# EAGLE design LP-IMP-P1_V3 (EAGLE 7.7.0)

## Sheet 1 of 3
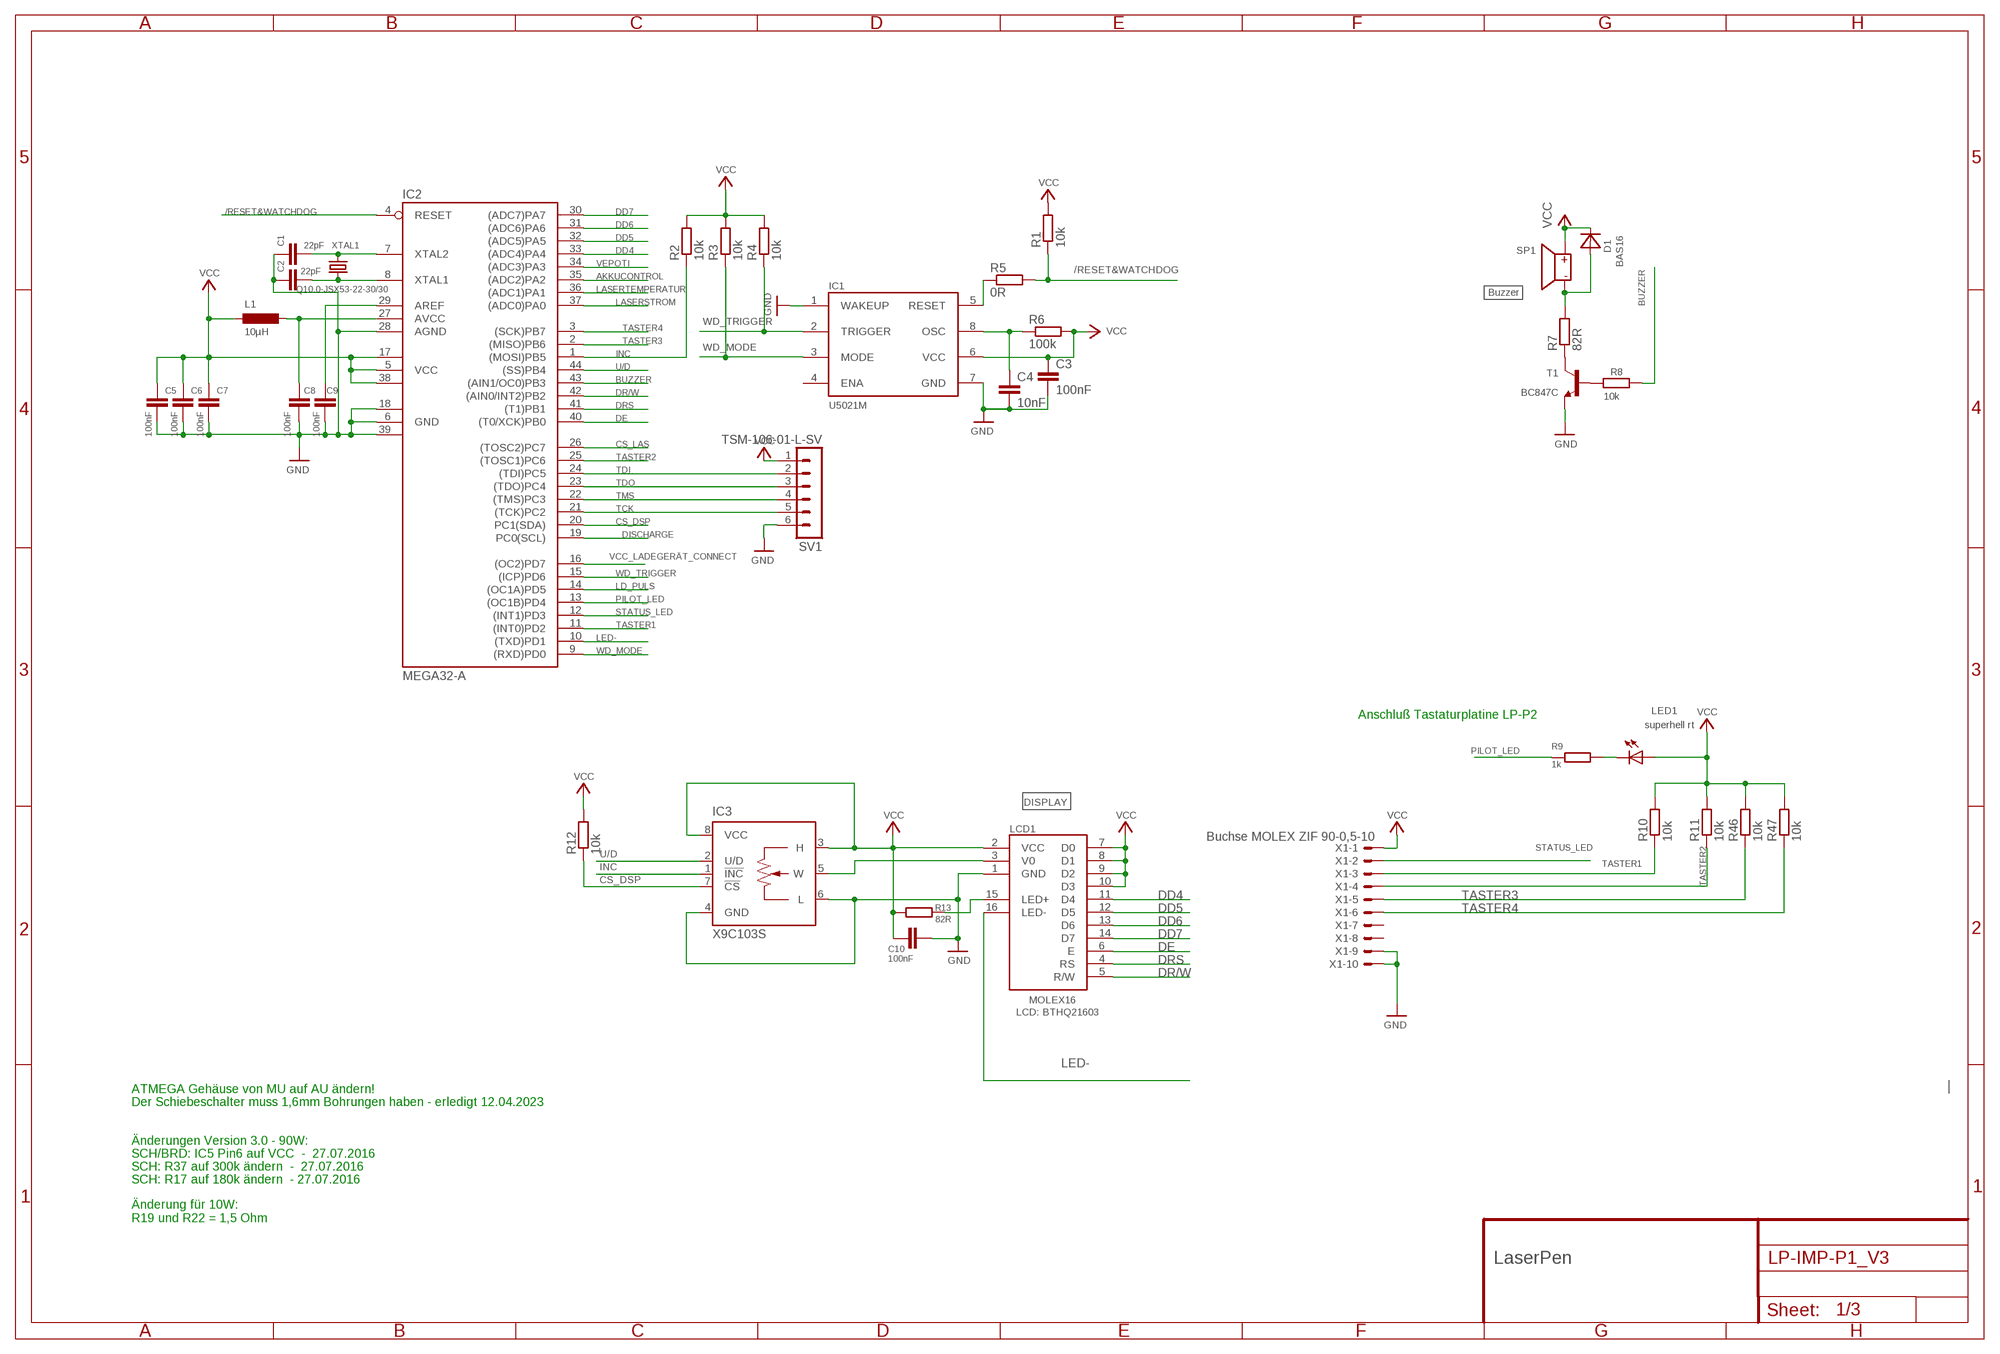
[diagram p0: schematic, sheet 1]

### Parts
C1  22pF  C-EUC0603  [C0603]
C2  22pF  C-EUC0603  [C0603]
C3  100nF  C-EUC0603  [C0603]
C4  10nF  C-EUC0603  [C0603]
C5  100nF  C-EUC0603  [C0603]
C6  100nF  C-EUC0603  [C0603]
C7  100nF  C-EUC0603  [C0603]
C8  100nF  C-EUC0603  [C0603]
C9  100nF  C-EUC0603  [C0603]
C10  100nF  C-EUC0603  [C0603]
D1  BAS16  [DIODE_SOT23]
IC1  U5021M  [SOIC8]
IC2  MEGA32-A  [TQFP44]
IC3  X9C103S  X9C102S  [SOIC08]
L1  10µH  L-EU  [R1210]
LCD1  MOLEX16  LCD1  [MOLEX]
LED1  superhell rt  LED3MM  [LED3MM]
R1  10k  R-EU_R0603  [R0603]
R2  10k  R-EU_R0603  [R0603]
R3  10k  R-EU_R0603  [R0603]
R4  10k  R-EU_R0603  [R0603]
R5  0R  R-EU_R0603  [R0603]
R6  100k  R-EU_R0603  [R0603]
R7  82R  R-EU_MELF0204R  [MINI_MELF-0204R]
R8  10k  R-EU_R0603  [R0603]
R9  1k  R-EU_R0603  [R0603]
R10  10k  R-EU_R0603  [R0603]
R11  10k  R-EU_R0603  [R0603]
R12  10k  R-EU_R0603  [R0603]
R13  82R  R-EU_MELF0204R  [MINI_MELF-0204R]
R46  10k  R-EU_R0603  [R0603]
R47  10k  R-EU_R0603  [R0603]
SP1  BUZZERS  [BUZZER]
SV1  TSM-106-01-L-SV  MA06-1MA06-1-SMD  [MA06-1-SMD]
T1  BC847C  BC848  [SOT23]
X1  Buchse MOLEX ZIF 90-0,5-10  53-10  [52745-1090]
XTAL1  Q10.0-JSX53-22-30/30  JSX53  [JSX53]

### Nets
/RESET&WATCHDOG: IC2.4(RESET) R1.1 R5.2
AKKUCONTROL: IC2.35((ADC2)PA2) ; also sheet 3
AREF: C9.1 IC2.29(AREF)
AVCC: C8.1 IC2.27(AVCC) L1.1
BUZZER: IC2.43((AIN1/OC0)PB3) R8.1
CS_DSP: IC2.20(PC1(SDA)) IC3.7(!CS) R12.1
CS_LAS: IC2.26((TOSC2)PC7) ; also sheet 2
DD4: IC2.33((ADC4)PA4) LCD1.11(D4)
DD5: IC2.32((ADC5)PA5) LCD1.12(D5)
DD6: IC2.31((ADC6)PA6) LCD1.13(D6)
DD7: IC2.30((ADC7)PA7) LCD1.14(D7)
DE: IC2.40((T0/XCK)PB0) LCD1.6(E)
DISCHARGE: IC2.19(PC0(SCL)) ; also sheet 2
DR/W: IC2.42((AIN0/INT2)PB2) LCD1.5(R/W)
DRS: IC2.41((T1)PB1) LCD1.4(RS)
GND: C1.1 C2.1 C3.2 C4.2 C5.2 C6.2 C7.2 C8.2 C9.2 C10.1 IC1.1(WAKEUP) IC1.7(GND) IC2.6(GND) IC2.18(GND1) IC2.28(AGND) IC2.39(GND2) IC3.4(GND) IC3.6(L) LCD1.1(GND) SV1.6 T1.2(E) X1.9 X1.10 ; also sheet 2,3
INC: IC2.1((MOSI)PB5) IC3.1(!INC) R2.1 ; also sheet 2
LASERSTROM: IC2.37((ADC0)PA0) ; also sheet 2
LASERTEMPERATUR: IC2.36((ADC1)PA1) ; also sheet 2
LD_PULS: IC2.14((OC1A)PD5) ; also sheet 2
LED+: LCD1.15(LED+) R13.2
LED-: IC2.10((TXD)PD1) LCD1.16(LED-)
N$2: R7.1 T1.3(C)
N$6: C1.2 IC2.7(XTAL2) XTAL1.3
N$11: IC1.5(RESET) R5.1
N$12: C4.1 IC1.8(OSC) R6.1
N$13: LED1.K(C) R9.2
N$21: C2.2 IC2.8(XTAL1) XTAL1.1
N$29: D1.1(A) R7.2 SP1.-
N$35: R8.2 T1.1(B)
PILOT_LED: IC2.13((OC1B)PD4) R9.1
STATUS_LED: IC2.12((INT1)PD3) X1.2
TASTER1: IC2.11((INT0)PD2) R10.1 X1.3
TASTER2: IC2.25((TOSC1)PC6) R11.1 X1.4
TASTER3: IC2.2((MISO)PB6) R46.1 X1.5
TASTER4: IC2.3((SCK)PB7) R47.1 X1.6
TCK: IC2.21((TCK)PC2) SV1.5
TDI: IC2.24((TDI)PC5) SV1.2
TDO: IC2.23((TDO)PC4) SV1.3
TMS: IC2.22((TMS)PC3) SV1.4
U/D: IC2.44((SS)PB4) IC3.2(U/D) ; also sheet 2
V0: IC3.5(W) LCD1.3(V0)
VCC: C3.1 C5.1 C6.1 C7.1 C10.2 D1.3(C) IC1.6(VCC) IC2.5(VCC) IC2.17(VCC1) IC2.38(VCC2) IC3.3(H) IC3.8(VCC) L1.2 LCD1.2(VCC) LCD1.7(D0) LCD1.8(D1) LCD1.9(D2) LCD1.10(D3) LED1.A R1.2 R2.2 R3.2 R4.2 R6.2 R10.2 R11.2 R12.2 R13.1 R46.2 R47.2 SP1.+ SV1.1 X1.1 ; also sheet 2,3
VCC_LADEGERÄT_CONNECT: IC2.16((OC2)PD7) ; also sheet 3
VEPOTI: IC2.34((ADC3)PA3) ; also sheet 2
WD_MODE: IC1.3(MODE) IC2.9((RXD)PD0) R3.1
WD_TRIGGER: IC1.2(TRIGGER) IC2.15((ICP)PD6) R4.1
Unconnected: IC1.4(ENA) X1.7 X1.8

### Notes on the sheet
- Buzzer
- Anschluß Tastaturplatine LP-P2
- DISPLAY
- LCD: BTHQ21603
- ATMEGA Gehäuse von MU auf AU ändern!
- Der Schiebeschalter muss 1,6mm Bohrungen haben - erledigt 12.04.2023
- Änderungen Version 3.0 - 90W:
- SCH/BRD: IC5 Pin6 auf VCC  -  27.07.2016
- SCH: R37 auf 300k ändern  -  27.07.2016
- SCH: R17 auf 180k ändern  - 27.07.2016
- Änderung für 10W:
  R19 und R22 = 1,5 Ohm
- LaserPen

## Sheet 2 of 3
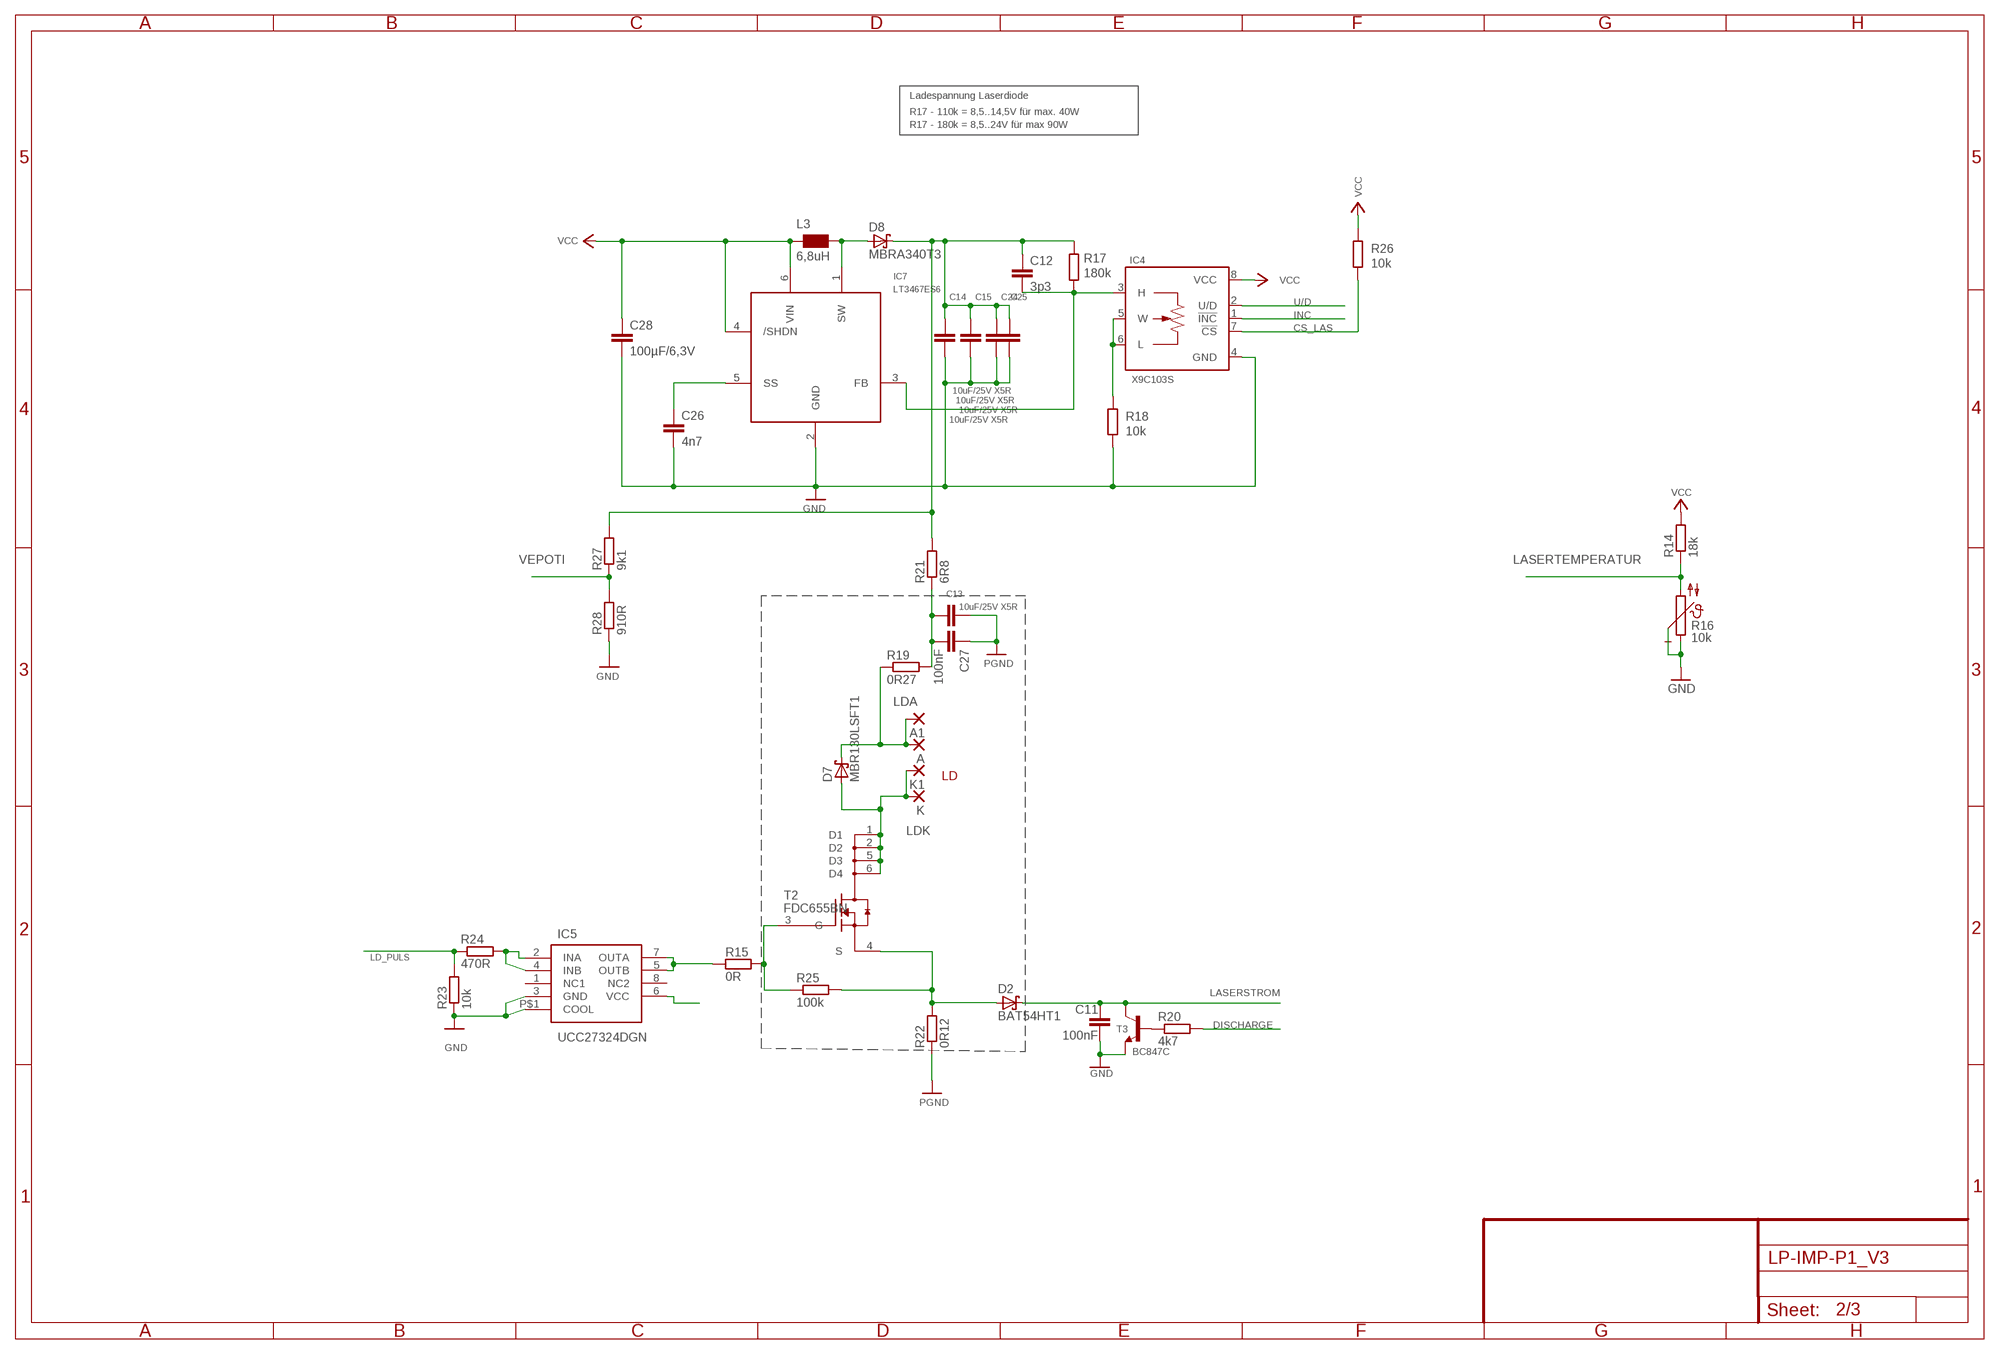
[diagram p1: schematic, sheet 2]

### Parts
A  WIREPADSMD1,27-254  [SMD1,27-2,54]
A1  WIREPADSMD1,27-254  [SMD1,27-2,54]
C11  100nF  C-EUC0603  [C0603]
C12  3p3  C-EUC0603  [C0603]
C13  10uF/25V X5R  C-EUC1210K  [C1210K]
C14  10uF/25V X5R  C-EUC1210K  [C1210K]
C15  10uF/25V X5R  C-EUC1210K  [C1210K]
C24  10uF/25V X5R  C-EUC1210K  [C1210K]
C25  10uF/25V X5R  C-EUC1210K  [C1210K]
C26  4n7  C-EUC0603K  [C0603K]
C27  100nF  C-EUC0603  [C0603]
C28  100µF/6,3V  C-EUC1210K  [C1210K]
D2  BAT54HT1  [SOD-323]
D7  MBR130LSFT1  [SOD-123LF]
D8  MBRA340T3  [SMA]
IC4  X9C103S  X9C102S  [SOIC08]
IC5  UCC27324DGN  [R-PDSO-G8]
IC7  LT3467ES6  [TSOT-23-6]
K  WIREPADSMD1,27-254  [SMD1,27-2,54]
K1  WIREPADSMD1,27-254  [SMD1,27-2,54]
L3  6,8uH  WE-PD2_S  [WE-PD2_S]
R14  18k  R-EU_R0603  [R0603]
R15  0R  R-EU_MELF0204R  [MINI_MELF-0204R]
R16  10k  NTC640SMD0805  [R0805]
R17  180k  R-EU_R0603  [R0603]
R18  10k  R-EU_R0603  [R0603]
R19  0R27  R-EU_MELF0204R  [MINI_MELF-0204R]
R20  4k7  R-EU_R0603  [R0603]
R21  6R8  R-EU_MELF0204R  [MINI_MELF-0204R]
R22  0R12  R-EU_MELF0204R  [MINI_MELF-0204R]
R23  10k  R-EU_R0603  [R0603]
R24  470R  R-EU_R0603  [R0603]
R25  100k  R-EU_R0603  [R0603]
R26  10k  R-EU_R0603  [R0603]
R27  9k1  R-EU_R0603  [R0603]
R28  910R  R-EU_R0603  [R0603]
T2  FDC655BN  [SUPERSOT-6]
T3  BC847C  BC849SMD  [SOT23-BEC]

### Nets
CS_LAS: IC4.7(!CS) R26.1 ; also sheet 1
DISCHARGE: R20.2 ; also sheet 1
GND: C11.2 C13.2 C14.2 C15.2 C24.2 C25.2 C26.2 C27.1 C28.2 IC4.4(GND) IC5.3(GND) IC5.P$1(COOL) IC7.2(GND) R16.1 R18.1 R22.1 R23.1 R28.1 T3.E ; supply symbol labelled PGND ; also sheet 1,3
INC: IC4.1(!INC) ; also sheet 1
LASERSTROM: C11.1 D2.C T3.C ; also sheet 1
LASERTEMPERATUR: R14.1 R16.2 ; also sheet 1
LD_PULS: R23.2 R24.1 ; also sheet 1
LDA: A1.1(P) A.1(P) D7.C R19.1
LDK: D7.A K1.1(P) K.1(P) T2.1(D1) T2.2(D2) T2.5(D3) T2.6(D4)
N$3: IC5.5(OUTB) IC5.7(OUTA) R15.1
N$8: IC5.2(INA) IC5.4(INB) R24.2
N$10: IC4.5(W) IC4.6(L) R18.2
N$15: R20.1 T3.B
N$18: C26.1 IC7.5(SS)
N$19: R15.2 R25.1 T2.3(G)
N$37: D8.A IC7.1(SW) L3.1
N$38: C13.1 C27.2 R19.2 R21.1
N$43: C12.2 IC4.3(H) IC7.3(FB) R17.1
U/D: IC4.2(U/D) ; also sheet 1
VCC: C28.1 IC4.8(VCC) IC5.6(VCC) IC7.4(/SHDN) IC7.6(VIN) L3.2 R14.2 R26.2 ; also sheet 1,3
VEPOTI: R27.1 R28.2 ; also sheet 1
VPULS: C12.1 C14.1 C15.1 C24.1 C25.1 D8.C R17.2 R21.2 R27.2
ZWISCHENWERT: D2.A R22.2 R25.2 T2.4(S)
Unconnected: IC5.1(NC1) IC5.8(NC2)

### Notes on the sheet
- Ladespannung Laserdiode
- R17 - 110k = 8,5..14,5V für max. 40W
- R17 - 180k = 8,5..24V für max 90W
- LD

## Sheet 3 of 3
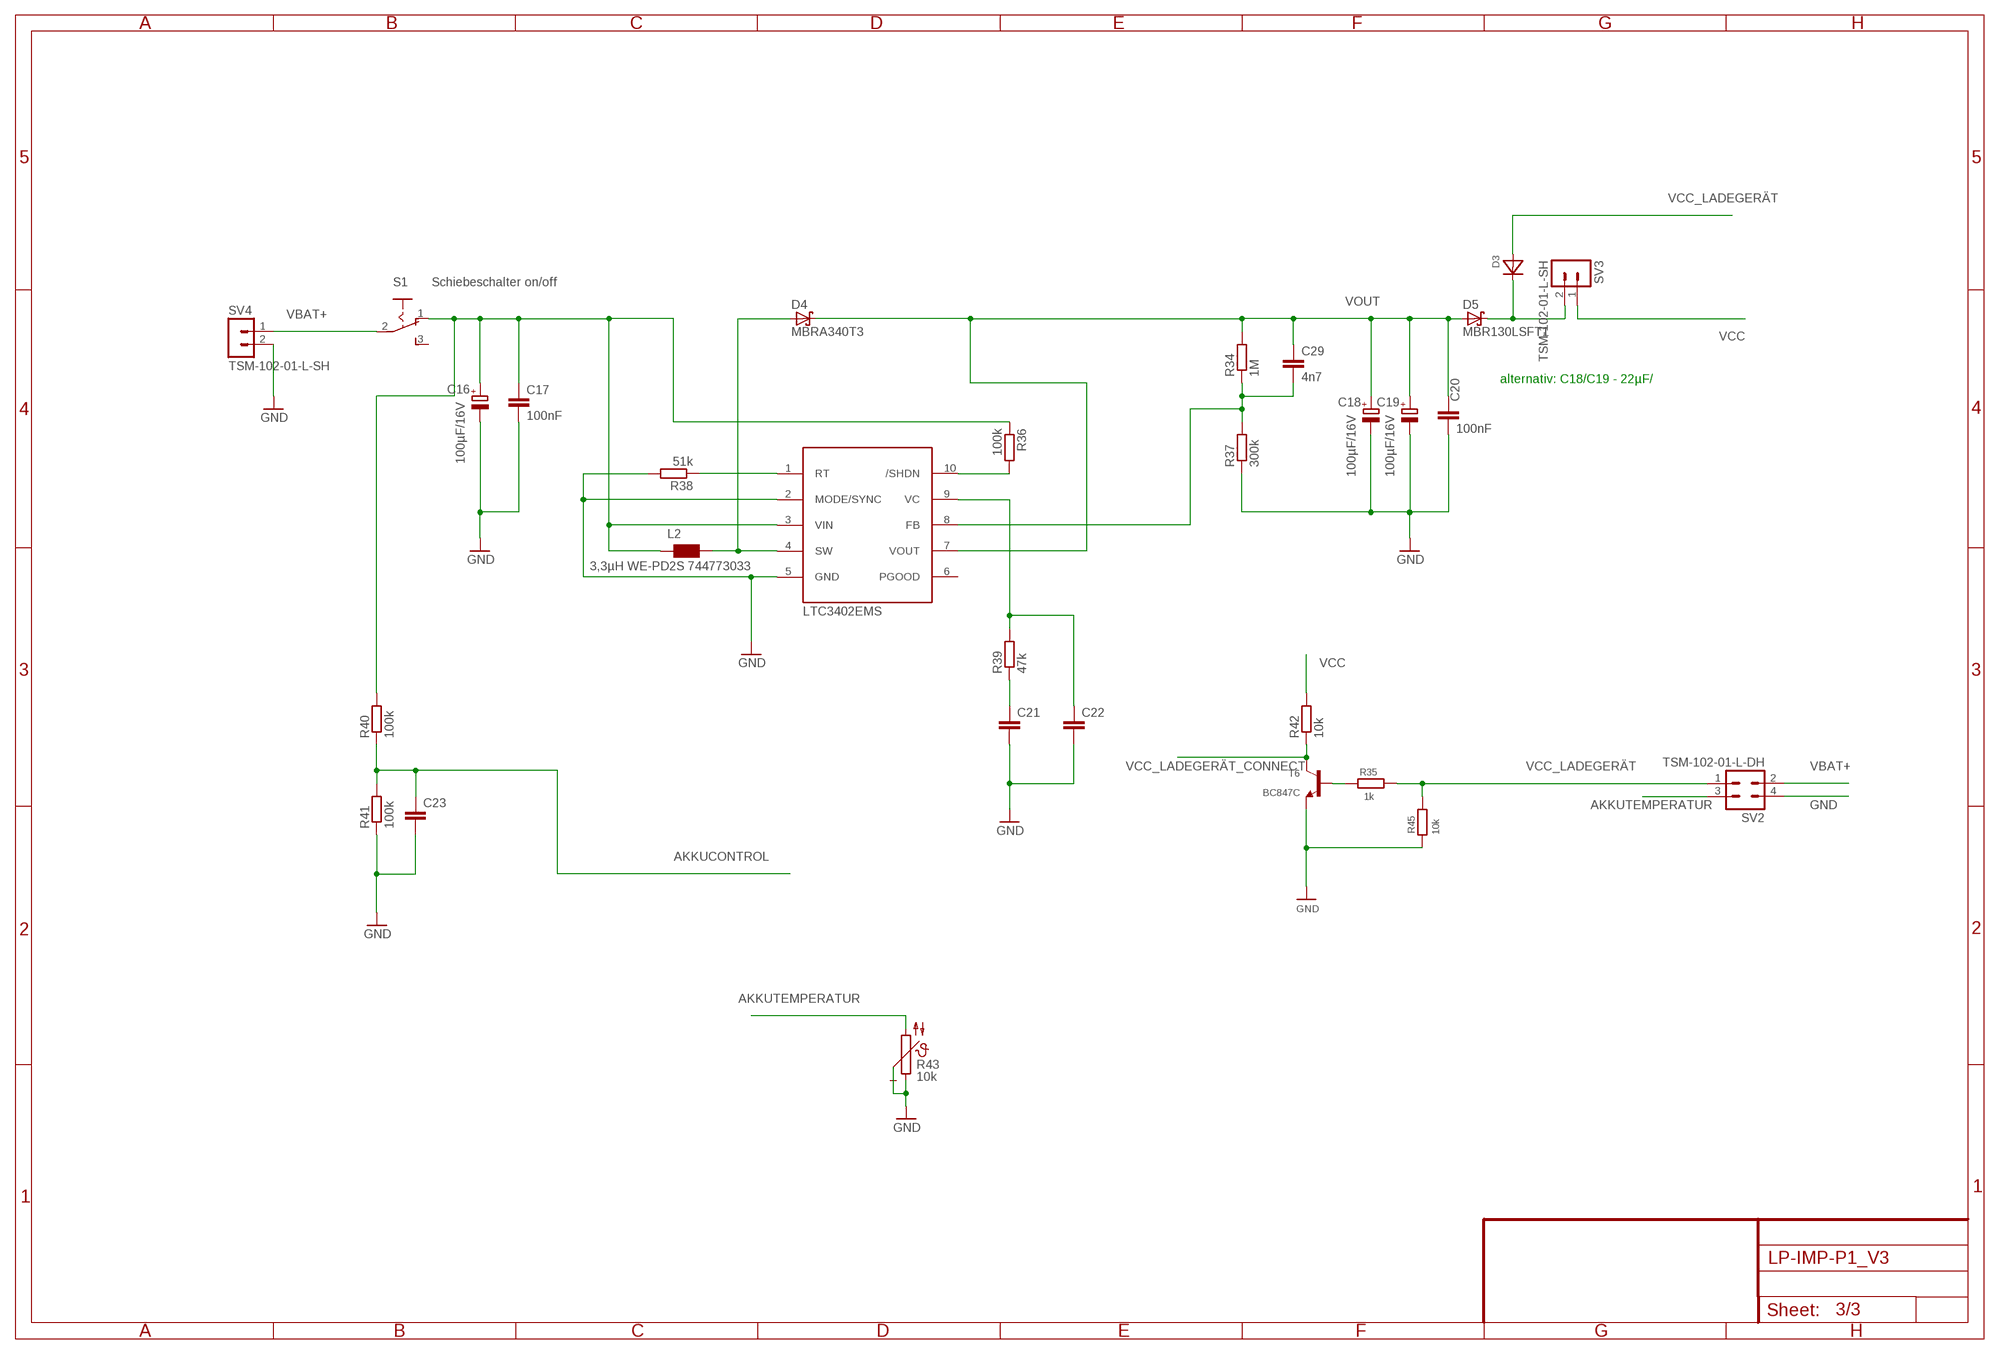
[diagram p2: schematic, sheet 3]

### Parts
C16  100µF/16V  CPOL-EUSMCD  [SMC_D]
C17  100nF  C-EUC0603K  [C0603K]
C18  100µF/16V  CPOL-EUSMCD  [SMC_D]
C19  100µF/16V  CPOL-EUSMCD  [SMC_D]
C20  100nF  C-EUC0603K  [C0603K]
C21  1nF  C-EUC0603K  [C0603K]
C22  10pF  C-EUC0603K  [C0603K]
C23  100nF  C-EUC0603K  [C0603K]
C29  4n7  C-EUC0603K  [C0603K]
D3  BAS16  [DIODE_SOT23]
D4  MBRA340T3  [SMA]
D5  MBR130LSFT1  [SOD-123LF]
IC6  LTC3402EMS  [MSOP-10]
L2  3,3µH WE-PD2S 744773033  WE-PD2_S  [WE-PD2_S]
R34  1M  R-EU_R0603  [R0603]
R35  1k  R-EU_R0603  [R0603]
R36  100k  R-EU_R0603  [R0603]
R37  300k  R-EU_R0603  [R0603]
R38  51k  R-EU_R0603  [R0603]
R39  47k  R-EU_R0603  [R0603]
R40  100k  R-EU_R0603  [R0603]
R41  100k  R-EU_R0603  [R0603]
R42  10k  R-EU_R0603  [R0603]
R43  10k  NTC640SMD0805  [R0805]
R45  10k  R-EU_R0603  [R0603]
S1  Schiebeschalter on/off  255SB  [255SB]
SV2  TSM-102-01-L-DH  MA02-2  [MA02-2-W-SMD]
SV3  TSM-102-01-L-SH  MA02-1W-SMD  [MA02-1-W-SMD]
SV4  TSM-102-01-L-SH  MA02-1W-SMD  [MA02-1-W-SMD]
T6  BC847C  BC848  [SOT23]

### Nets
AKKUCONTROL: C23.1 R40.1 R41.2 ; also sheet 1
AKKUTEMPERATUR: R43.2 SV2.3
GND: C16.- C17.2 C18.- C19.- C20.2 C21.2 C22.2 C23.2 IC6.2(MODE/SYNC) IC6.5(GND) R37.1 R38.2 R41.1 R43.1 R45.2 SV2.4 SV4.2 T6.2(E) ; also sheet 1,2
N$4: D3.3(C) D5.C SV3.2
N$7: R35.2 T6.1(B)
N$23: C29.2 IC6.8(FB) R34.1 R37.2
N$24: C22.1 IC6.9(VC) R39.2
N$32: C21.1 R39.1
N$34: D4.A IC6.4(SW) L2.1
N$36: IC6.1(RT) R38.1
N$39: IC6.10(/SHDN) R36.2
VBAT+: S1.2(P) SV2.2 SV4.1
VCC: R42.2 SV3.1 ; also sheet 1,2
VCC_LADEGERÄT: D3.1(A) R35.1 R45.1 SV2.1
VCC_LADEGERÄT_CONNECT: R42.1 T6.3(C) ; also sheet 1
VIN: C16.+ C17.1 IC6.3(VIN) L2.2 R36.1 R40.2 S1.1(O)
VOUT: C18.+ C19.+ C20.1 C29.1 D4.C D5.A IC6.7(VOUT) R34.2
Unconnected: IC6.6(PGOOD) S1.3(S)

### Notes on the sheet
- alternativ: C18/C19 - 22µF/

## Library data of the parts
A A1 K K1 = wirepad:WIREPAD: Wire PAD connect wire on PCB
C1-C15 C17 C20-C29 = rcl:C-EU: CAPACITOR, European symbol
C16 C18 C19 = rcl:CPOL-EU: POLARIZED CAPACITOR, European symbol
D1 D3 = vv32_4.10.2004_rc2vvmega32_04.10.2004_rc2:BAS16
D2 = pulslaser:BAT54HT1
D4 = LS-SP-P1:MBRA340T3
D5 D7 = pulslaser:MBR130LSFT1
D8 = pulslaser:MBRA340T3
IC1 = atmel:U5021
IC2 = atmel:MEGA32: MICROCONTROLLER 32 Kbytes FLASH 2 Kbytes SRAM 1 Kbytes EEPROM USART 8-channel 10 bit ADC Source: www.atmel.com .. doc2503.pdf
IC3 IC4 = pot-xicor:X9C102*: Digital POTENTIOMETER
IC5 = pulslaser:UCC27324DGN
IC6 = pulslaser:LTC3402EMS
IC7 = pulslaser:LT3467ES6
L1 = rcl:L-EU: INDUCTOR, European symbol
L2 = wuerth-elektronik_EAGLE_v4:WE-PD2: SMD-Power Inductors WE-PD2 Is recommended for the application with switching regulators from National Semiconductor, Linear Technology, Texas Instruments and Fairchild Semiconductor -- Switching regulators with low operating voltages (computer, laptop, mobile phones, pagers) -- Integrated DC/DC-converter
L3 = wuerth-elektronik:WE-PD2: SMD-Power Inductors WE-PD2 Is recommended for the application with switching regulators from National Semiconductor, Linear Technology, Texas Instruments and Fairchild Semiconductor -- Switching regulators with low operating voltages (computer, laptop, mobile phones, pagers) -- Integrated DC/DC-converter
LCD1 = IBB:LCD: LCD, 2x16, Batron
LED1 = led:LED: LED OSRAM: - CHIPLED LG R971, LG N971, LY N971, LG Q971, LY Q971, LO R971, LY R971 LH N974, LH R974 LS Q976, LO Q976, LY Q976 LO Q996 - Hyper CHIPLED LW Q18S LB Q993, LB Q99A, LB R99A - SideLED LS A670, LO A670, LY A670, LG A670, LP A670 LB A673, LV A673, LT A673, LW A673 LH A674 LY A675 LS A676, LA A676, LO A676, LY A676, LW A676 LS A679, LY A679, LG A679 - Hyper Micro SIDELED® LS Y876, LA Y876, LO Y876, LY Y876 LT Y87S - SmartLED LW L88C, LW L88S LB L89C, LB L89S, LG L890 LS L89K, LO L89K, LY L89K LS L896, LA L896, LO L896, LY L896 - TOPLED LS T670, LO T670, LY T670, LG T670, LP T670 LSG T670, LSP T670, LSY T670, LOP T670, LYG T670 LG T671, LOG T671, LSG T671 LB T673, LV T673, LT T673, LW T673 LH T674 LS T676, LA T676, LO T676, LY T676, LB T676, LH T676, LSB T676, LW T676 LB T67C, LV T67C, LT T67C, LS T67K, LO T67K, LY T67K, LW E67C LS E67B, LA E67B, LO E67B, LY E67B, LB E67C, LV E67C, LT E67C LW T67C LS T679, LY T679, LG T679 LS T770, LO T770, LY T770, LG T770, LP T770 LB T773, LV T773, LT T773, LW T773 LH T774 LS E675, LA E675, LY E675, LS T675 LS T776, LA T776, LO T776, LY T776, LB T776 LHGB T686 LT T68C, LB T68C - Hyper Mini TOPLED® LB M676 - Mini TOPLED Santana® LG M470 LS M47K, LO M47K, LY M47K Source: http://www.osram.convergy.de/
R1-R15 R17-R28 R34-R42 R45-R47 = rcl:R-EU_: RESISTOR, European symbol
R16 R43 = ptc-ntc:NTC640: PHILIPS NTC
S1 = switch:255SB: SLIDING SWITCH Distributor Buerklin, 11G810
SP1 = IBB:BUZZER: ST03CH, Buzzer, 5V, SMD, Soberton
SV1 = con-lstb:MA06-1: PIN HEADER
SV2 = con-lstb:MA02-2
SV3 SV4 = con-lstb:MA02-1
T1 T6 = transistor:BC848: NPN TRANSISTOR
T2 = pulslaser:FDC655BN
T3 = transistor-npn:BC849*: NPN Transistor
X1 = con-molex:53?-10: CONNECTOR wire to board 1.25 mm (.049 inch) pitch header
XTAL1 = pulslaser:JSX53

## Board
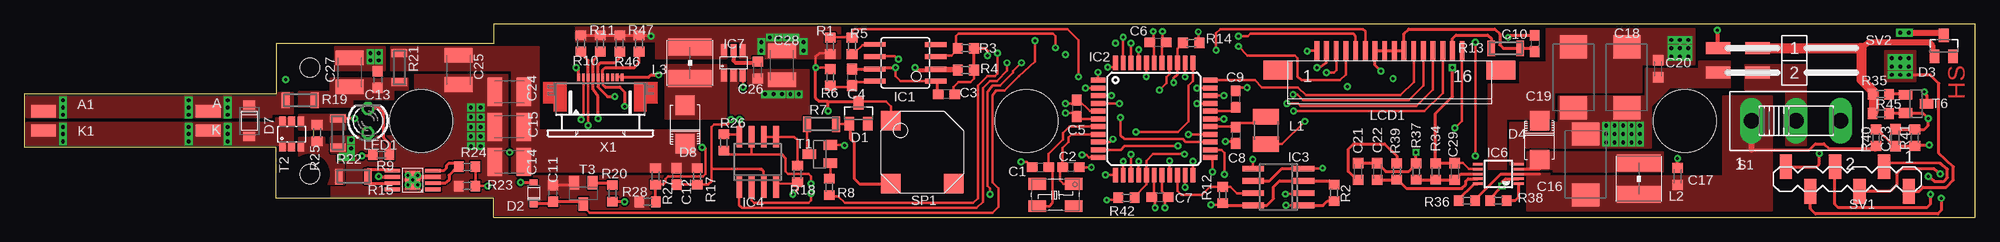
[diagram p3: board, top side]
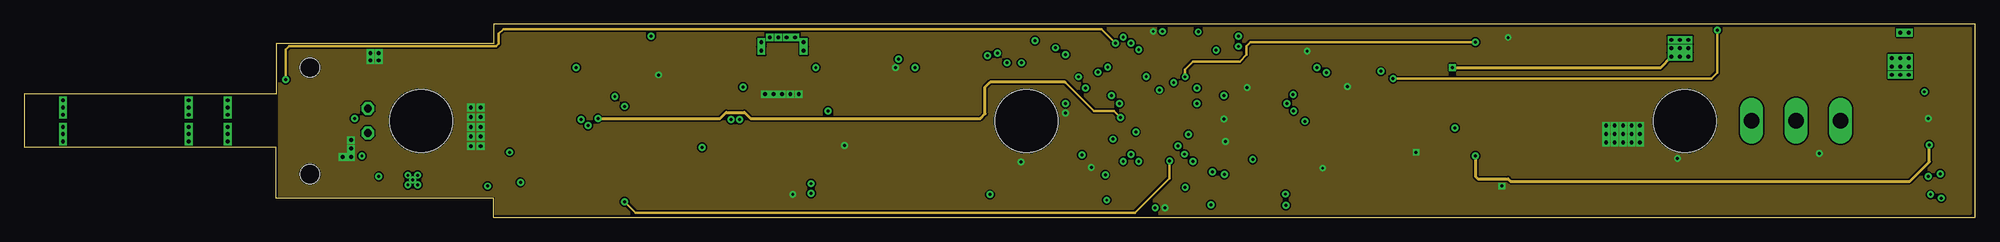
[diagram p4: board, inner layer gnd]
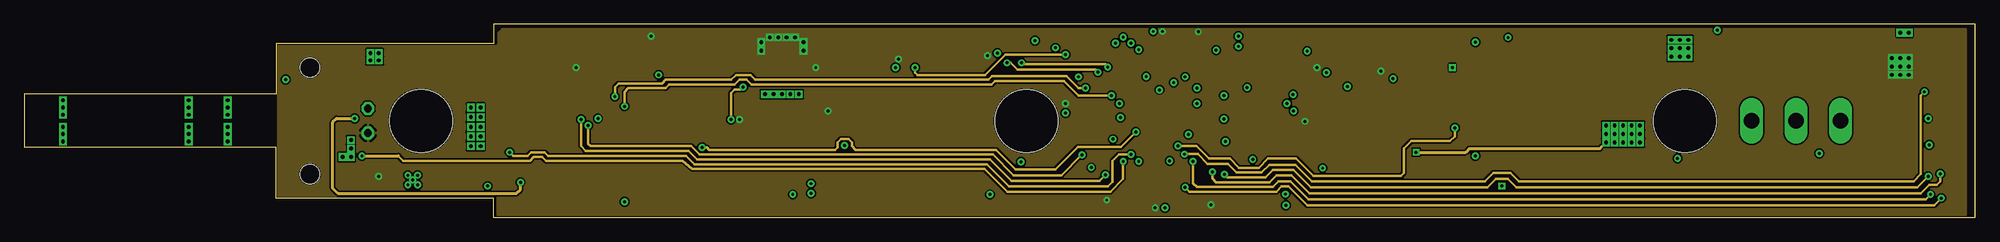
[diagram p5: board, inner layer vcc]
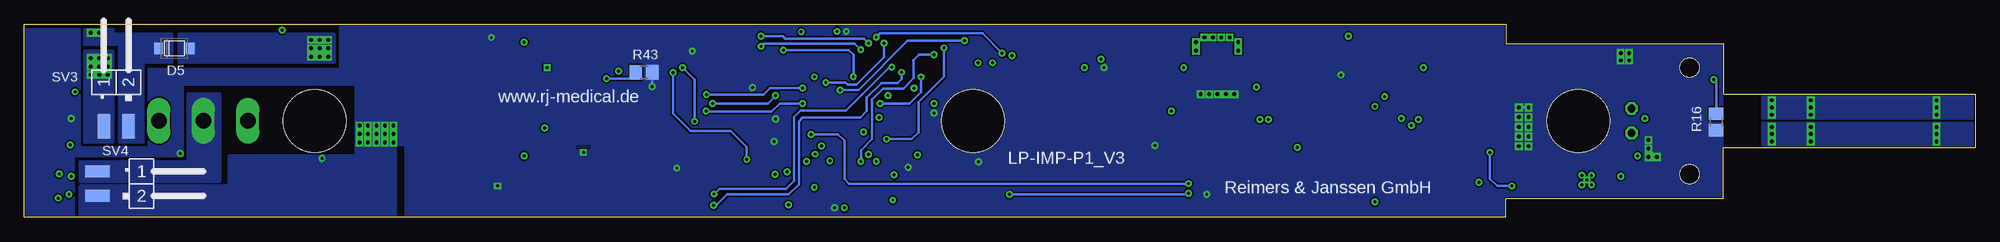
[diagram p6: board, bottom side, seen from below]

Size 201.5 x 20 mm. Coordinates in mm from the lower left corner, seen from the top.
Copper layers (1+2*15+16): Top 0.035mm / dielectric 0.4mm / gnd 0.035mm / dielectric 0.8mm / vcc 0.035mm / dielectric 0.4mm / Bottom 0.035mm
Design rules "default_simon *": minimum track width 10mil, minimum drill 0.3mm, track to track 6mil, track to pad 6mil, pad to pad 6mil, via to via 6mil, smd to smd 4mil, copper to edge 4mil, drill to drill 8mil, minimum pad ring 10mil, minimum via ring 8mil, stop-mask expansion 4mil, vias tented up to drill 0mil, thermal gap 10mil
bKeepout: area 26,15 to 34,18; area 26,2 to 34,5

### Footprints (pad centres in the part's own frame; a part is rotated, then mirrored left to right if it is on the bottom)
SMD1,27-2,54 = smd 1.27 x 2.54: 1 0,0
C0603 = smd 1.1 x 1: 1 -0.85,0; 2 0.85,0
C1210K = smd 1.5 x 2.9: 1 -1.5,0; 2 1.5,0
SMC_D = smd 2.4 x 2.8: + -3.15,0; - 3.15,0
C0603K = smd 1.05 x 1.08: 1 -0.875,0; 2 0.875,0
DIODE_SOT23 = smd 1 x 1.4: 1 -0.95,-1.1; 2 0.95,-1.1; 3 0,1.1
SOD-323 = smd 0.63 x 0.83: A 1.11,0; C -1.11,0
SMA = smd 2 x 2: A 2,0; C -2,0
SOD-123LF = smd 0.91 x 1.22: A 1.635,0; C -1.635,0
SOIC8 = smd 0.5 x 2.2: 1 -1.905,-3.154; 2 -0.645,-3.154; 3 0.625,-3.154; 4 1.895,-3.154; 5 1.905,3.154; 6 0.635,3.154; 7 -0.635,3.154; 8 -1.905,3.154
TQFP44 = smd 1.5 x 0.5: 1 -5.8,4; 2 -5.8,3.2; 3 -5.8,2.4; 4 -5.8,1.6; 5 -5.8,0.8; 6 -5.8,0; 7 -5.8,-0.8; 8 -5.8,-1.6; 9 -5.8,-2.4; 10 -5.8,-3.2; 11 -5.8,-4; 23 5.8,-4; 24 5.8,-3.2; 25 5.8,-2.4; 26 5.8,-1.6; 27 5.8,-0.8; 28 5.8,0; 29 5.8,0.8; 30 5.8,1.6; 31 5.8,2.4; 32 5.8,3.2; 33 5.8,4 | smd 0.5 x 1.5: 12 -4,-5.8; 13 -3.2,-5.8; 14 -2.4,-5.8; 15 -1.6,-5.8; 16 -0.8,-5.8; 17 0,-5.8; 18 0.8,-5.8; 19 1.6,-5.8; 20 2.4,-5.8; 21 3.2,-5.8; 22 4,-5.8; 34 4,5.8; 35 3.2,5.8; 36 2.4,5.8; 37 1.6,5.8; 38 0.8,5.8; 39 0,5.8; 40 -0.8,5.8; 41 -1.6,5.8; 42 -2.4,5.8; 43 -3.2,5.8; 44 -4,5.8
SOIC08 = smd 0.6 x 2.2: 1 -1.905,-2.6; 2 -0.635,-2.6; 3 0.635,-2.6; 4 1.905,-2.6; 5 1.905,2.6; 6 0.635,2.6; 7 -0.635,2.6; 8 -1.905,2.6
R-PDSO-G8 = smd 0.4 x 1.6: 1 -0.975,-2.1; 2 -0.325,-2.105; 3 0.325,-2.1; 4 0.975,-2.1; 5 0.975,2.1; 6 0.325,2.1; 7 -0.325,2.1; 8 -0.975,2.1 | smd 1.905 x 1.575: P$1 0,0
MSOP-10 = smd 0.25 x 1: 1 -1,-2.113; 2 -0.5,-2.113; 3 0,-2.113; 4 0.5,-2.113; 5 1,-2.113; 6 1,2.113; 7 0.5,2.113; 8 0,2.113; 9 -0.5,2.113; 10 -1,2.113
TSOT-23-6 = smd 0.62 x 1.22: 1 -0.95,-1.31; 2 0,-1.31; 3 0.95,-1.31; 4 0.95,1.31; 5 0,1.31; 6 -0.95,1.31
R1210 = smd 1.6 x 2.7: 1 -1.4,0; 2 1.4,0
WE-PD2_S = smd 1.75 x 4.5: 1 -1.625,0; 2 1.625,0
MOLEX = smd 0.5 x 2: 1 7.5,0; 2 6.5,0; 3 5.5,0; 4 4.5,0; 5 3.5,0; 6 2.5,0; 7 1.5,0; 8 0.5,0; 9 -0.5,0; 10 -1.5,0; 11 -2.5,0; 12 -3.5,0; 13 -4.5,0; 14 -5.5,0; 15 -6.5,0; 16 -7.5,0 | smd 3 x 2: P$1 -11.5,2; P$2 11.5,2
LED3MM = drill 0.813 octagon: A -1.27,0; K 1.27,0
R0603 = smd 1 x 1.1: 1 -0.85,0; 2 0.85,0
MINI_MELF-0204R = smd 0.8 x 1.6: 1 -1.5,0; 2 1.5,0
R0805 = smd 1.3 x 1.5: 1 -0.85,0; 2 0.85,0
255SB = drill 1.6 long: 1 -4.6,0; 2 0,0; 3 4.6,0
BUZZER = smd 2 x 2: + 1,7.5; - 1,1; P$3 7.5,1
MA06-1-SMD = smd 1.27 x 2.54: 1 -6.35,1.27; 2 -3.81,-1.27; 3 -1.27,1.27; 4 1.27,-1.27; 5 3.81,1.27; 6 6.35,-1.27
MA02-2-W-SMD = smd 1.27 x 2.54: 1 -1.27,-3.81; 2 1.27,-3.81; 3 -1.27,-7.874; 4 1.27,-7.874
MA02-1-W-SMD = smd 1.27 x 2.54: 1 -1.27,-4.572; 2 1.27,-4.572
SOT23 = smd 1 x 1.4: 1 -0.95,-1.1; 2 0.95,-1.1; 3 0,1.1
SUPERSOT-6 = smd 0.7 x 1: 1 -0.95,-1.3; 2 0,-1.3; 3 0.95,-1.3; 4 0.95,1.3; 5 0,1.3; 6 -0.95,1.3
SOT23-BEC = smd 1 x 1.4: B -0.95,-1.1; C 0,1.1; E 0.95,-1.1
LASERPEN_IMP = hole 2: 12.5,4.5; 12.5,15.5 | hole 6.5: 24,10; 86.5,10; 154.5,10
52745-1090 = smd 0.3 x 0.8: 1 -2.25,2.5; 2 -1.75,2.5; 3 -1.25,2.5; 4 -0.75,2.5; 5 -0.25,2.5; 6 0.25,2.5; 7 0.75,2.5; 8 1.25,2.5; 9 1.75,2.5; 10 2.25,2.5
JSX53 = smd 1.8 x 1.2: 1 -1.9,-1.15; 2 1.9,-1.15; 3 1.9,1.15; 4 -1.9,1.15

### Placement (x,y rotation side)
A  19,11 90 top
A1  2,11 90 top
C1  104.95,5.2 0 top
C2  108.1,5.2 180 top
C3  95.25,12.75 180 top
C4  85.5,14.5 90 top
C5  108.7,11.3 270 top
C6  117.08,18.1 180 top
C7  117.3,2.1 0 top
C8  125.12,8.5 270 top
C9  125.12,12.25 90 top
C10  156,18 270 top
C11  54.62,2.5 90 top
C12  67.38,4.25 270 top
C13  33.62,15 90 top
C14  50.12,5.75 180 top
C15  50.12,9.38 180 top
C16  161.25,5.5 90 top
C17  170.75,4.25 90 top
C18  165.5,14.5 270 top
C19  160,14.5 270 top
C20  168.75,15.38 270 top
C21  137.75,4.75 90 top
C22  139.75,4.75 90 top
C23  193.25,8.25 90 top
C24  50.12,13 180 top
C25  44.88,15.25 270 top
C26  75.75,15.25 270 top
C27  36.5,14.25 270 top
C28  78.25,15.75 270 top
C29  147.75,4.75 270 top
D1  86.17,10.78 0 top
D2  52.62,2.5 90 top
D3  198.25,17.75 0 top
D4  156.5,8 270 top
D5  186,17.5 0 bottom
D7  23.25,10 270 top
D8  68.25,9.62 90 top
IC1  91,16 90 top
IC2  116.7,10.2 0 top
IC3  129.54,3.15 90 top
IC4  75.75,5.75 0 top
IC5  40.12,3.88 90 top
IC6  152.25,4.5 90 top
IC7  73.25,16 0 top
K  19,9 90 top
K1  2,9 90 top
L1  128.25,9 270 top
L2  166.75,4 270 top
L3  68.75,16 90 top
LCD1  141,17.25 180 top
LED1  35.5,10 90 top
R1  83.25,17.75 270 top
R2  135.28,2.55 90 top
R3  97.25,17.5 0 top
R4  97.25,15.25 0 top
R5  85.5,17.75 90 top
R6  83.25,14.5 90 top
R7  82.36,9.67 0 top
R8  83.15,3.16 90 top
R9  36.88,6.5 0 top
R10  57.5,18 90 top
R11  59.5,18 90 top
R12  123.78,2.33 270 top
R13  153,17.5 180 top
R14  120.53,18.05 0 top
R15  34,4.25 180 top
R16  26.75,9.88 90 bottom
R17  69.5,4.25 90 top
R18  79.88,4.5 90 top
R19  28.5,12.12 0 top
R20  60.75,2.5 270 top
R21  38.75,15.5 90 top
R22  32.38,8.75 90 top
R23  45.75,3.25 0 top
R24  45.75,5.25 180 top
R25  30.25,8.75 90 top
R26  72.25,7.75 90 top
R27  65.2,4.26 90 top
R28  64.38,1.62 0 top
R34  145.75,4.75 90 top
R35  191.75,12.75 0 top
R36  149,1.75 180 top
R37  143.75,4.75 270 top
R38  152.25,1.75 180 top
R39  141.75,4.75 270 top
R40  191.25,8.25 270 top
R41  195.25,8.25 270 top
R42  113.85,2.05 180 top
R43  137.5,15 180 bottom
R45  191.75,10.75 0 top
R46  61.5,18 90 top
R47  63.5,18 90 top
S1  183,10 0 top
SP1  88.5,2.5 0 top
SV1  188.28,3.97 180 top
SV2  182.81,16.25 270 top
SV3  192,14 0 bottom
SV4  189.38,3.5 270 bottom
T1  82.16,6.56 90 top
T2  27.62,8.62 0 top
T3  57.75,2.5 180 top
T6  195.38,11.75 270 top
U$1  [LASERPEN_IMP]  17,0 0 top
X1  59.5,12 0 top
XTAL1  106.51,2.32 180 top

### Tracks (layer width: path | path; a pad name or v marks a point on that pad's centre or on a via)
/RESET&WATCHDOG  (via drill 0.3)
  Top 0.254: 83.97,18.63 83.41,18.57 83.61,18.63 83.97,18.63 | 83.97,18.63 85.37,18.63 85.5,18.5 R5.2 85.5,19.25 85.75,19.5 107.75,19.5 108.9,18.35 v108.9,14.55 | 83.97,18.63 R1.1 | v113.1,11.8 IC2.4
  Bottom 0.254: v113.1,11.8 110.05,11.8 108.9,12.95 v108.9,14.55
AKKUCONTROL  (via drill 0.3)
  Top 0.254: v149.88,18.12 v149.88,6.38 | IC2.35 v119.9,14.55
  Top 0.305: 193.12,7.38 191.4,9.1 | C23.1 195.22,7.38 R41.2 195.35,7.5 v196.75,7.5
  Top 0.406: C23.1 193.12,7.38 | 191.4,9.1 R40.1
  gnd 0.254: v149.88,18.12 126.62,18.12 126.25,17.75 126.25,16.82 125.55,16.12 120.72,16.12 119.9,15.3 v119.9,14.55
  gnd 0.305: v149.88,6.38 149.88,4.25 150.12,4 153.25,4 153.5,3.75 194.75,3.75 196.75,5.75 v196.75,7.5
AKKUTEMPERATUR  (via drill 0.3)
  Top 0.406: SV2.3 174.9,17.52 174.9,17.5 174.88,17.5 v174.88,19.38
  gnd 0.254: v141.38,14.38 174.25,14.38 174.88,15 v174.88,19.38
  Bottom 0.254: R43.2 138.5,14.62 138.75,14.38 v141.38,14.38
AREF
  Top 0.254: IC2.29 124.72,11 C9.1
AVCC
  Top 0.254: L1.1 128.75,10 128.75,10.75 128.5,10 128.25,9.75 125.53,9.75 C8.1 125.08,9.4 IC2.27
BUZZER  (via drill 0.3)
  Top 0.254: R8.1 83.15,2.37 83.31,2.21 84.04,2.21 84.75,1.5 98,1.5 98.5,2 98.5,13.62 99.5,14.62 100.25,14.62 100.5,14.88 v100.5,17 | v113.5,18.65 IC2.43
  Bottom 0.254: v113.5,18.65 113.1,19.05 102.55,19.05 v100.5,17
CS_DSP
  Top 0.254: IC3.7 126.88,2.45 126.88,2.5 125.25,2.5 124.58,3.17 R12.1 122.47,3.17 121.65,2.35 119.5,2.35 119.1,2.75 IC2.20
CS_LAS  (via drill 0.3)
  Top 0.254: R26.1 72.22,6.9 72.62,6.5 75.12,6.5 | 75.12,7 75.12,7.62 IC4.7 75.12,8.47 75.12,7 | 75.12,6.5 75.12,7 | 75.12,6.5 78.25,6.5 78.62,6.12 78.62,4.75 78.88,4.5 81,4.5 81.25,4.25 v81.25,3.5 | v120.25,8.6 IC2.26
  Bottom 0.254: v81.25,3.5 116.3,3.5 116.8,4 116.8,7.95 117.45,8.6 v120.25,8.6
DD4
  Top 0.254: LCD1.11 143.5,14 142.15,12.65 132.35,12.65 131.55,13.45 127.85,13.45 127.1,14.2 IC2.33
DD5  (via drill 0.3)
  Top 0.254: LCD1.12 144.5,13.62 143.03,12.15 132.05,12.15 131.5,12.7 v131.05,12.7 | IC2.32 v121.1,13.4
  Bottom 0.254: v121.1,13.4 124.45,13.4 125.15,12.7 v131.05,12.7
DD6  (via drill 0.3)
  Top 0.254: v130.4,11.8 131.55,11.8 131.8,11.55 143.8,11.55 145.5,13.25 LCD1.13 | IC2.31 v123.9,12.6
  Bottom 0.254: v123.9,12.6 124.7,11.8 v130.4,11.8
DD7  (via drill 0.3)
  Top 0.254: v131.1,11 144.62,11 146.5,12.88 LCD1.14 | v121.1,11.8 IC2.30
  Bottom 0.254: v131.1,11 131.05,10.95 124.3,10.95 123.45,11.8 v121.1,11.8
DE  (via drill 0.3, 0.3 pad 0.3)
  Top 0.254: v115.88,14.57 115.9,14.6 IC2.40 | LCD1.6 138.5,19.25 138.25,19.5 123.55,19.5 123.1,19.05 v123.1,17.3
  Bottom 0.254: v123.1,17.3 116.35,17.3 115.88,16.82 v115.88,14.57
DISCHARGE  (via drill 0.3, 0.3 pad 0.4)
  Top 0.254: v118.3,5.84 IC2.19
  Top 0.305: R20.2 61.98,1.65 v62,1.62
  gnd 0.254: v62,1.62 63.15,0.47 114.72,0.47 118.3,4.05 v118.3,5.84
DR/W  (via drill 0.3)
  Top 0.254: LCD1.5 137.5,18.75 137.25,19 126.62,19 126.38,18.75 v125.4,18.75 | v114.3,18.05 IC2.42
  Bottom 0.254: v125.4,18.75 123.15,18.75 122.9,18.5 114.75,18.5 v114.3,18.05
DRS  (via drill 0.3, 0.3 pad 0.71)
  Top 0.254: LCD1.4 136.5,14.8 135.9,14.2 131.9,14.2 131.5,14.6 131.5,16.5 131.25,16.75 126.35,16.75 v125.4,17.7 | IC2.41 v115.1,17.35
  Bottom 0.254: v115.1,17.35 115.75,18 125.1,18 v125.4,17.7
GND  (via drill 0.3, 0.3 pad 0.3, 0.3 pad 0.4, 0.4)
  Top 0.254: T1.2 84.67,7.51 v84.74,7.45 | 94.03,14.13 94.12,14.04 IC1.1 94.04,14.14 94.03,14.13 | IC1.7 88,15.5 88.5,15.5 | v90,15.5 90,14.62 90.5,14.13 94.03,14.13 | LCD1.1 132.75,17.25 132.7,17.2 v132.5,17.2 | IC4.4 77.66,3.4 77.75,3.5 79.85,3.52 79.88,3.62 R18.1 79.88,2.88 v79.38,2.38 | IC2.18 117.5,2.75 C7.2 117.8,1.75 v117.8,1 | IC2.39 116.7,17.62 C6.2 116.6,18.48 v116.6,19.25 | IC3.4 134.06,5.06 v134.1,5.1 | v110.2,5.16 108.99,5.16 C2.1 | C9.2 125.47,13.45 v126.3,13.45 | C8.2 124.92,7.85 v124.05,7.85 | C1.1 103.54,5.76 v102.95,5.76 | IC2.6 108.95,10.2 C5.2 108.35,10.8 v107.55,10.8
  Top 0.305: IC1.1 94.13,14 94.25,14 94.25,12.75 C3.2 | IC3.6 128.61,3.79 129.88,5.06 IC3.4 | X1.9 X1.10 64.5,14.5 64.75,14.75 v65.5,14.75 | C4.2 88.35,15.35 88.5,15.5 v90,15.5 | C17.2 v170.75,6.12 | 194.28,10.75 T6.2 | 194.28,10.75 R45.2 | C23.2 195.12,9.12 195.12,9.1 R41.1 195.25,9.12 196.25,9.12 196.62,9.5 v196.62,10.25 196.12,10.75 194.28,10.75 | SV1.6 185.12,5.24 185.38,5.5 v185.38,6.62 | C10.1 153.47,18.85 v153.25,18.62 | R38.2 151.38,1.88 v152.62,3.25 152.62,3.62 153,4 IC6.2 | C21.2 C22.2 140.62,4.75 143,4.75 143.75,5.5 R37.1 v143.75,6.75 | T3.E 56.8,3.62 56.88,3.75 56.48,3.35 C11.2 | IC2.28 v123.9,10.2
  Top 0.406: IC5.P$1 40.12,4 40.33,4.2 IC5.3
  vcc 0.305: v143.75,6.75 148.88,6.75 149.25,7.12 162.75,7.12 v163.38,7.75
  Bottom 0.254: R43.1 v136.65,13.55
  Bottom 0.305: v46.12,11.38 v47.12,11.38
  other vias: 36.62,17 46.12,7.38 47.12,9.38 47.12,7.38 47.12,8.38 47.12,10.38 77.38,12.75 80,12.75 79.12,12.75 78.25,12.75 76.5,12.75 33.75,8 35.75,17 35.75,16.25 164.25,9.5 163.38,9.5 163.38,8.62 164.25,8.62 164.25,7.75 165.12,7.75 165.12,8.62 165.12,9.5 166,9.5 166.88,9.5 166.88,8.62 166.88,7.75 166,8.62 166,7.75 36.62,16.25 32.88,6.25 33.75,7.12 33.75,6.25 46.12,10.38 46.12,9.38 46.12,8.38 40.12,3.88
  pour Top (no thermals): 153.5,5.5 153.5,9.75 158.5,9.75 158.5,12.5 167.5,12.5 167.5,15.38 173,15.38 173,16.12 176.12,16.12 176.12,13.5 170,13.5 168,11.5 168,7.25 154.75,7.25 154.75,5.5
  pour gnd (rank 2): 26.38,19.5 26.38,0.5 201,0.5 201,19.5
  pour Bottom (rank 2, no thermals): 48.75,19.75 168.88,19.75 168.88,15.38 188.62,15.38 188.62,7.25 195.75,7.25 195.75,19.5 201.25,19.5 201.25,0.25 196.38,0.25 196.38,6.38 185.12,6.38 185.12,13.75 167.25,13.75 167.25,7.5 162.12,7.5 162.12,0.25 48.75,0.25 48.75,2.25 26.12,2.25 26.12,17.75 48.75,17.75
  pour Top (no thermals): 73,15.25 81,15.25 81,10.12 73,10.12
  pour Top (rank 3, no thermals): 31.75,8.38 40.38,8.38 40.38,14.75 49.88,14.75 49.88,4.25 73,4.25 73,0.25 31.75,0.25
  pour Bottom (no thermals): 163.12,9.75 167.25,9.75 167.25,6.38 180.38,6.38 180.38,3.25 195.75,3.25 195.75,0.25 163.12,0.25
  pour Top (no thermals): 32.12,15.25 37.25,15.25 37.25,17.62 32.12,17.62
  pour Top (no thermals): 31.75,8.25 34.12,8.25 34.12,5.88 32.5,5.88 32.5,6.75 31.75,6.75
INC  (via drill 0.3, 0.3 pad 0.3)
  Top 0.254: IC3.1 132.14,1.2 132.09,1.25 v130.3,1.25 | v101.5,16 101.5,15.18 100.45,14.12 99.75,14.12 99,13.38 99,1.62 98.38,1 74.12,1 73.84,1.28 IC4.1 | IC2.1 110.89,14.21 v110.89,15.02
  Top 0.305: IC3.1 134.15,1.25 134.6,1.7 R2.1
  vcc 0.254: v101.5,16 101.88,16 102.6,15.28 110.63,15.28 v110.89,15.02
  Bottom 0.254: v130.3,1.25 130.05,1.25 128.9,2.4 122.55,2.4 121.5,3.45 121.5,9.95 121.1,10.35 115.15,10.35 114.5,11 114.5,12.4 112.98,13.92 111.28,13.92 110.89,14.32 v110.89,15.02
LASERSTROM  (via drill 0.3)
  Top 0.254: C11.1 57.35,1.65 | 58,0.88 58.38,0.5 100,0.5 100.62,1.12 100.62,3 100,3.62 100,12.62 100.38,13.12 101.25,13.12 102.75,14.62 104.38,16.1 v104.38,18.3 | IC2.37 118.3,14.85 117.95,14.5 117.95,13.9 v117.25,13.2
  Top 0.305: D2.C 54.52,1.39 54.62,1.5 C11.1 57.48,1.65 57.75,1.38 T3.C | 57.35,1.65 58,1 58,0.88
  Bottom 0.254: v104.38,18.3 110.25,18.3 115.35,13.2 v117.25,13.2
LASERTEMPERATUR  (via drill 0.3)
  Top 0.254: R14.1 119.1,17.48 IC2.36 119.1,14.79 118.72,14.41 v118.72,13.96
  gnd 0.254: v27,14.25 27,17.38 27.38,17.75 48.75,17.75 49,18 49,19 49.5,19.5 111.25,19.5 v112.7,18.05
  Bottom 0.254: R16.2 26.75,10.75 26.5,10.75 26.75,11 26.75,14 v27,14.25 | v118.72,13.96 116.67,13.96 116.46,13.75 115.55,13.75 112.7,16.6 v112.7,18.05
LD_PULS  (via drill 0.3)
  Top 0.254: v47.88,3.25 R23.2 46.6,5.28 46.5,5.38 R24.1 | v114.29,6.51 IC2.14
  vcc 0.254: v50.12,6.75 50.5,6.38 52,6.38 52.38,6.75 53.75,6.75 54.12,6.38 68.38,6.38 69.25,5.5 99.45,5.5 101.71,3.24 111.94,3.24 112.4,3.7 112.4,5.85 113.06,6.51 v114.29,6.51
  Bottom 0.254: v50.12,6.75 50.12,4 49.38,3.25 v47.88,3.25
LDA  (via drill 0.4)
  other vias: 21,10.62 21,11.38 21,12.12 17,10.62 17,11.38 17,12.12 4,10.62 4,11.38 4,12.12
  pour Top (no thermals): 0.25,12.5 26.25,12.5 26.25,12.88 27.75,12.88 27.75,10.75 25.5,10.75 25.5,10.38 0.25,10.38
  pour Bottom (no thermals): 0.25,12.5 22,12.5 22,10.25 0.25,10.25
LDK  (via drill 0.4)
  other vias: 4,9.38 4,8.62 4,7.88 17,9.38 17,8.62 17,7.88 21,9.38 21,8.62 21,7.88
  pour Top (no thermals): 0.25,9.75 0.25,7.5 26.75,7.5 26.75,7 27.75,7 27.75,10.25 26,10.25 26,9.75
  pour Bottom (no thermals): 0.25,9.75 22,9.75 22,7.5 0.25,7.5
LED+
  Top 0.3: LCD1.15 147.5,18.5 147.88,18.88 151.12,18.88 151.5,18.5 R13.2
LED-  (via drill 0.3)
  Top 0.254: v147.75,9.25 148.5,10 LCD1.16 | IC2.10 113.25,7 113.65,7.4 v119.15,7.4
  vcc 0.254: v147.75,9.25 147.75,8.4 147.25,7.9 143.25,7.9 142.5,7.15 142.5,4.6 142.2,4.3 133.15,4.3 131.35,6.1 128.45,6.1 127.5,5.15 125.45,5.15 124.5,6.1 122.35,6.1 121.05,7.4 v119.15,7.4
N$1  (via drill 0.3 pad 0.4)
  other vias: 39.62,4.38
N$2
  Top 0.254: T1.3 81.06,6.63 81.08,6.65 80.85,6.88 R7.1
N$3
  Top 0.305: IC5.7 35.5,3.55 R15.1 35.5,4.97 38,4.97 38,4.88 IC5.5
N$4  (via drill 0.4 pad 0.3)
  Top 0.61: D3.3 198.12,19.12 v194.62,19.12 v193.75,19.12
  Bottom 0.61: v193.75,19.12 v194.62,19.12
  pour Bottom (no thermals): 189.25,7.75 191.62,7.75 191.62,17.88 195.25,17.88 195.25,19.5 192.38,19.5 192.38,19 186.25,19 186.25,16 189.25,16
N$5
  pour gnd: 143.25,7.25 144.25,7.25 144.25,6.38 143.25,6.38
N$6
  Top 0.254: XTAL1.3 105.87,1.17 106.2,1.5 106.2,4.8 C1.2 105.8,6.55 107.3,8.05 107.3,8.75 107.95,9.4 IC2.7
N$7
  Top 0.305: T6.1 194.25,12.7 194.38,12.62 194.25,12.75 R35.2
N$8
  Top 0.305: IC5.4 43.35,4.85 43.62,5.12 43.62,5.38 43.88,5.62 45,5.62 44.62,5.25 | IC5.2 43.42,3.55 43.88,3.88 43.88,4.38 44.62,5.12 44.62,5.25 | 44.62,5.25 R24.2
N$9
  pour Bottom: 143.25,7.25 144.25,7.25 144.25,6.38 143.25,6.38
N$10
  Top 0.254: IC4.6 77.6,8.35 77.62,8.38 77.62,8.35 IC4.5 79.53,8.35 79.88,8 R18.2
N$11
  Top 0.254: IC1.5 87.88,17.88 87.85,17.85 86.57,17.85 85.81,17.09 85.68,17.02 85.77,16.99 85.57,16.99 R5.1
N$12
  Top 0.254: IC1.8 86.89,14.04 86.75,14.03 85.57,14.03 C4.1 85.5,13.5 83.77,13.51 83.67,13.61 R6.1
N$13
  Top 0.305: LED1.K 36.73,11.27 37.12,10.88 37.12,8.25 37.75,7.62 37.75,6.62 37.73,6.62 R9.2
N$14  (via drill 0.3 pad 0.4)
  other vias: 40.62,4.38
N$15
  Top 0.305: R20.1 60.75,3.38 60.52,3.6 T3.B
N$16  (via drill 0.3 pad 0.4)
  other vias: 40.62,3.38
N$17  (via drill 0.3 pad 0.4)
  other vias: 39.62,3.38
N$18
  Top 0.406: IC7.5 73.25,16.25 73.5,16 75.75,16 C26.1
N$19
  pour Top (rank 2, no thermals): 28.38,8.25 28.38,3.5 33,3.5 33,7.5 31,7.5 31,8.25
N$21
  Top 0.254: XTAL1.1 107.33,3.47 106.95,3.85 106.95,4.9 C2.2 107.25,7.2 107.85,7.8 107.85,8.3 108.15,8.6 IC2.8
N$23
  Top 0.305: IC6.8 148.38,4.5 C29.2 145.75,3.88 R34.1 143.78,3.9 143.75,3.88 R37.2
N$24
  Top 0.305: C22.1 141.75,3.88 R39.2 141.75,4 142.75,3 148.5,3 148.88,3.38 148.88,3.75 149.12,4 IC6.9
N$29
  Top 0.254: D1.1 85.36,9.68 85.37,9.67 R7.2
  Top 0.305: 85.36,9.68 85.36,8.14 85.75,7.75 85.75,4 86.25,3.5 SP1.-
N$32
  Top 0.305: 137.62,3.88 136.75,4.75 136.75,7.08 137.3,7.62 140.5,7.62 141.75,6.38 R39.1
  Top 0.406: C21.1 137.62,3.88
N$34
  Top 0.305: IC6.4 156.5,5
  pour Top (no thermals): 155.25,5 158,5 158,4.75 169.25,4.75 169.25,6.75 155.25,6.75
N$35
  Top 0.254: R8.2 83.15,4.11 83.26,4.22 T1.1
N$36
  Top 0.305: IC6.1 154.36,2.11 154,1.75 R38.1
N$37
  pour Top (no thermals): 66.25,15.75 66.25,10.25 72.5,10.25 72.5,15.75
N$38
  pour Top (no thermals): 28.38,13 31.62,13 31.62,14.38 39.62,14.38 39.62,13.25 38.12,13.25 38.12,12.25 33.88,12.25 33.88,11.5 28.38,11.5
N$39
  Top 0.305: R36.2 148.15,1.88 148.12,1.88 149.75,3.5 IC6.10
N$43  (via drill 0.3)
  Top 0.254: C12.2 69.4,3.4 69.5,3.5 R17.1 70.65,3.4 71,3.75 71,5 | 76,5 76.12,5 76.38,4.75 | 76.38,4.75 76.38,2.77 IC4.3 76.38,4.75 | 76.38,4.75 76.13,4.99 76.01,4.99 76,5 | IC7.3 74.25,14.69 v74.25,13.5 | 71,5 76,5 | 71,5 71,9.38 71.25,9.62 72.62,9.62 v73,10.12
  vcc 0.254: v73,10.12 73,12.88 73.38,13.25 74,13.25 v74.25,13.5
PILOT_LED  (via drill 0.3, 0.3 pad 0.4)
  Top 0.254: IC2.13 v113.5,5.8
  Top 0.305: R9.1 36,6.5 35.88,6.38 v34.88,6.38
  vcc 0.254: 38.62,6.38 39.12,5.88 52.25,5.88 52.62,6.25 53.5,6.25 53.88,5.88 68,5.88 69,5 99.2,5 101.53,2.67 112.17,2.67 113.5,4 v113.5,5.8
  vcc 0.305: v34.88,6.38 38.62,6.38
STATUS_LED  (via drill 0.3)
  Top 0.254: v57.5,10.12 57.5,10.38 57.75,10.62 X1.2 | IC2.12 v111.65,4.4
  vcc 0.254: v57.5,10.12 57.5,7.38 58,6.88 68.62,6.88 69.5,6 99.75,6 101.97,3.78 111.04,3.79 v111.65,4.4
TASTER1  (via drill 0.3)
  Top 0.254: v58.25,9.5 X1.3 | v109.25,6.46 109.7,6.46 109.96,6.2 IC2.11
  Top 0.305: R10.1 57.5,17 58.25,16.25 X1.3
  vcc 0.254: v58.25,9.5 58.25,7.62 58.5,7.38 68.88,7.38 69.75,6.5 100.05,6.5 102.17,4.38 107.12,4.38 109.2,6.46 v109.25,6.46
TASTER2  (via drill 0.3)
  Top 0.254: IC2.25 119.95,7.8 119.65,8.1 113.61,8.1 113.22,8.5 v113.22,10.35
  Top 0.305: R11.1 59.5,17 58.75,16.25 X1.4 58.75,13.25 59.25,12.5 v59.25,10.25
  gnd 0.254: v113.22,10.35 112.56,11 110.5,11 107.5,14
  gnd 0.305: 107.5,14 99.75,14 99.25,13.5 99.25,10.75 98.75,10.25 75,10.25 74.38,10.88 72.5,10.88 71.88,10.25 v59.25,10.25
TASTER3  (via drill 0.3)
  Top 0.254: v109.6,13.4 IC2.2
  Top 0.305: R46.1 61.5,16.5 61,16 59.5,16 59.25,15.75 X1.5 59.25,13.5 60.25,12.5 v61,12.5
  vcc 0.254: v61,12.5 61,13.5 61.38,13.88 65.88,13.88 66.25,14.25 73,14.25 73.5,14.75 75,14.75 75.5,14.25 99.58,14.25 99.95,14.62 107.65,14.62 108.88,13.4 v109.6,13.4
TASTER4  (via drill 0.3)
  Top 0.254: IC2.3 v112.3,12.6
  Top 0.305: R47.1 63.5,16 63,15.5 60,15.5 59.75,15.25 X1.6 59.75,13.75 60,13.5 61.5,13.5 62,13 v62,11.5
  vcc 0.254: v112.3,12.6 108.9,12.6 107.38,14.12 100.28,14.12 99.9,13.75 75.12,13.75 74.62,14.25 73.88,14.25 73.38,13.75 66.62,13.75 66.25,13.38 62.38,13.38 62,13 v62,11.5
TCK  (via drill 0.3, 0.3 pad 0.3)
  Top 0.254: IC2.21 v119.9,3.1
  Top 0.305: SV1.5 184.47,0.91 185,0.38 197.62,0.38 198,0.75 v198,2
  vcc 0.254: v198,2 197.25,1.25 132.5,1.25 130.55,3.2 129.85,3.2 129.3,2.65 120.35,2.65 v119.9,3.1
TDI  (via drill 0.3, 0.3 pad 0.3)
  Top 0.254: IC2.24 123.65,7 123.95,6.7 v123.95,4.45
  Top 0.305: SV1.2 192.09,5.33 192.38,5.62 197.88,5.62 198.62,5 198.62,4.12 198.25,3.75 197.25,3.75 v196.62,4.25
  vcc 0.254: v196.62,4.25 195.5,3.12 154.12,3.12 153.25,4 152,4 151.12,3.12 132.88,3.12 131.1,4.9 128.95,4.9 128.2,4.15 124.25,4.15 v123.95,4.45
TDO  (via drill 0.3, 0.3 pad 0.3)
  Top 0.254: IC2.23 122.72,6.2 v122.72,4.72
  Top 0.305: SV1.3 192.7,2.7 193.38,3.38 193.38,4.5 193.88,5 197.25,5 v197.88,4.5
  vcc 0.254: v122.72,4.72 122.72,4.03 123.1,3.65 128.6,3.65 129.3,4.35 129.5,4.35 130.89,4.34 132.72,2.5 195.88,2.5 196.75,3.38 197.5,3.38 197.88,3.75 v197.88,4.5
TMS  (via drill 0.3, 0.3 pad 0.3)
  Top 0.254: v120.7,5.8 IC2.22
  Top 0.305: SV1.4 187,1.37 187.38,1 196.5,1 196.88,1.38 v196.88,2.38
  vcc 0.254: v196.88,2.38 196.38,1.88 132.62,1.88 130.75,3.75 129.55,3.75 128.95,3.15 121.1,3.15 120.7,3.55 v120.7,5.8
U/D  (via drill 0.3)
  Top 0.254: IC3.2 132.04,2.42 v130.25,2.42 | v99.75,2.38 99.75,3 99.5,3.25 99.5,13 100,13.62 100.75,13.62 102.12,15 102.12,15.12 v103,16 | IC4.2 75.12,1.76 75.38,1.5 81,1.5 81.25,1.75 v81.25,2.5 | IC2.44 112.7,15.55 v111.9,15.55
  vcc 0.254: v103,16 103.15,15.85 111.65,15.85 111.9,15.6 v111.9,15.55
  Bottom 0.254: v111.9,15.55 112.15,15.55 116.65,11.05 121.33,11.05 122,10.38 122,3.77 122.8,2.97 129.7,2.97 v130.25,2.42 | v81.25,2.5 81.38,2.38 v99.75,2.38
V0  (via drill 0.3, 0.3 pad 0.71)
  Top 0.254: v134.5,15 135.25,15 135.5,15.25 LCD1.3 | v126.88,6 126.88,5.06
  Top 0.305: 126.88,5.06 IC3.5
  Bottom 0.254: v134.5,15 134.5,10.75 132.7,8.95 128.53,8.95 126.88,7.3 v126.88,6
VBAT+
  Top 0.3: S1.2 182.5,10.5
  pour Top (no thermals): 182,7.5 184,7.5 184,15.75 177.75,15.75 177.75,13.25 182,13.25
  pour Bottom (no thermals): 181.25,12.75 184.62,12.75 184.62,5.75 195.75,5.75 195.75,3.75 181.25,3.75
VCC  (via drill 0.3, 0.3 pad 0.3, 0.3 pad 0.4, 0.4)
  Top 0.254: SP1.+ 89.5,11.5 89,12 86.5,12 86.38,11.88 D1.3 | R1.2 arc60 83.5,17 82.12,17 81.75,16.62 v81.75,15.5 83.25,15.5 R6.2 | v90.31,16.39 89.89,16.68 87.93,16.68 87.88,16.62 IC1.6 | R4.2 98.1,14.35 97.75,14 96.5,14 96,13.5 96,12.75 | LCD1.2 134.5,16 133.75,15.5 | IC4.8 73.88,8.1 73.88,8.6 | R26.2 73.88,8.6 | 73.88,8.6 v73.88,10.12 | IC2.5 110.05,11 108.9,12.15 C5.1 108.35,11.8 v107.55,11.8 | IC2.38 117.5,17.68 C6.1 117.55,18.48 v117.55,19.25 | R14.2 121.25,18.18 v121.25,19.2 | v122.55,1.3 123.6,1.3 R12.2 124,1.25 | R42.2 112.75,1.8 v111.8,1.8 | L1.2 129.9,7.6 v132.25,9.95 | v116.8,1 116.8,1.75 C7.1 116.7,2.35 IC2.17
  Top 0.3: v133.5,15.5 133.75,15.5 | LCD1.7 139.5,15.75 v140.12,15.12
  Top 0.305: v57,15.5 57.25,15.25 X1.1 | R47.2 63.5,19 63.35,18.85 R46.2 61.5,19 61.35,18.85 R11.2 59.5,19 59.35,18.85 R10.2 64.5,18.85 v64.75,18.75 | v81.75,15.5 81.75,12.38 82.12,12 83,12 | D1.3 86,12 83,12 | v83,11 83,12 | v99.5,16.75 99.5,17.25 99.25,17.5 R3.2 R4.2 | C3.1 96,12.75 | R2.2 135.28,3.35 134.84,3.79 IC3.3 129.64,3.79 129.03,3.17 129.03,1.95 128.32,1.25 IC3.8 125.88,1.25 124,1.25 | LCD1.7 LCD1.8 LCD1.9 LCD1.10 142.5,19 143,19.5 151.88,19.5 152.38,19 152.38,17.88 152.75,17.5 R13.1 155.75,17.5 | SV1.1 195.7,2.7 196.12,3.12 198.5,3.12 199.25,3.88 199.25,5.25 197.75,6.62 197.75,13.88 196.88,14.75 v194.62,14.75 | IC5.6 36.62,4.2 v36.62,4.25
  Top 0.406: C10.2 156,17.25 155.75,17.5
  Bottom 0.254: v132.25,9.95 132.25,14.25 v133.5,15.5
  other vias: 193.75,14.75 192.88,14.75 192.88,16.5 193.75,16.5 192.88,15.62 193.75,15.62 194.62,15.62 79.62,18.62 78.75,18.62 77.88,18.62 77,18.62 80.5,17.25 194.62,16.5 76.12,18.12 80.5,18.12 76.12,17.25
  pour Top (no thermals): 192.2,17.19 192.2,14.13 195.28,14.13 195.28,17.19
  pour vcc: 26.25,17.75 48.75,17.75 49,18 49,19.12 49.38,19.5 200.5,19.5 200.5,0.25 48.88,0.25 48.88,2.25 26.25,2.25
  pour Bottom (no thermals): 192.38,17.25 192.38,7.75 195.25,7.75 195.25,17.25
  pour Top (no thermals): 84.25,19.62 57,19.62 57,18.25 65.25,18.25 65.25,16.5 72.5,16.5 72.5,18.25 74,18.25 74,16.5 84.25,16.5
VCC_LADEGERÄT
  Top 0.305: 189.62,17.52 189.62,17.5
  Top 0.406: R45.1 R35.1
  Top 0.61: D3.1 197.05,17.2 197.05,17.82 196.75,18.12 190.5,18.12 189.62,17.5
  Top 1.016: R45.1 191,11 191,13 189.75,14.25 189.75,17.5 189.73,17.52 189.62,17.52 SV2.1
VCC_LADEGERÄT_CONNECT  (via drill 0.3)
  Top 0.254: R42.1 114.7,2.2 115.9,3.4 IC2.16 115.9,5.86 116.59,6.55 v119.84,6.55
  Top 0.305: T6.3 196.5,11.75 196.5,12.62 v196.25,13
  vcc 0.254: v196.25,13 195.88,12.62 195.88,4.5 195.12,3.75 154.38,3.75 153.5,4.62 151.75,4.62 150.88,3.75 132.97,3.75 131.28,5.45 128.6,5.45 127.8,4.65 125.2,4.65 124.3,5.55 122.2,5.55 121.2,6.55 v119.84,6.55
VEPOTI  (via drill 0.3)
  Top 0.254: R27.1 66.03,3.41 66.25,3.62 66.25,4 66.5,4.25 70.12,4.25 70.38,4.5 70.38,7.12 70.25,7.25 v70,7.25 | v114.8,8.85 119.15,8.85 120.25,9.95 120.25,13.65 120.7,14.1 IC2.34
  Top 0.305: R27.1 65.2,3.5 65.25,3.5 65.22,3.48 R28.2
  vcc 0.254: v70,7.25 70.5,7.25 70.75,7 83.75,7 84,7.25 84,7.75 84.38,8.12 85.12,8.12 85.5,7.75 85.5,7.38 85.88,7 100.35,7 102.38,4.97 106.5,4.97 108.83,7.3 113.25,7.3 v114.8,8.85
VIN
  Top 0.305: 156.5,4.5 IC6.3 152.5,4.5 149.75,1.75 R36.1 | 178.4,7 184.38,7 185,7.62 185.88,7.62 186.38,7.12 191.12,7.12
  Top 0.61: 178.4,7 S1.1 | 191.12,7.12 191.12,7.4 R40.2
  pour Top (no thermals): 155.25,0.75 155.25,4.5 157.5,4.5 157.25,4.25 175.5,4.25 175.5,12.5 180.5,12.5 180.5,0.75
VOUT  (via drill 0.3 pad 0.4, 0.4)
  Top 0.254: C29.1 148.57,5.62 149.2,5 IC6.7
  Top 0.3: v171,16.62 v171,17.5 v171,18.38 v171.88,18.38 v171.88,17.5 v171.88,16.62
  Top 0.305: C29.1 145.88,5.62 145.88,5.6 R34.2 145.75,10.75 147.5,12.5 v147.5,15.5
  gnd 0.305: v147.5,15.5 169,15.5 v170.12,16.62
  other vias: 170.12,18.38 170.12,17.5
  pour Top (no thermals): 151.25,13.75 154.5,13.75 154.5,16 157.25,16 157.25,19.5 172.5,19.5 172.5,15.88 167,15.88 167,13 158,13 158,10.25 153,10.25 153,5 151.25,5
  pour Bottom (no thermals): 169.5,19 169.5,16 185.5,16 185.5,19
VPULS
  pour Top (no thermals): 37.88,17.62 37.88,15.25 50.38,15.25 50.38,4.75 69.75,4.75 69.75,9 53.12,9 53.12,17.62
WD_MODE  (via drill 0.3)
  Top 0.254: IC1.3 95.08,16.67 95,16.75 95.75,16.75 96.25,17.25 96.25,18.75 96.5,19 106.25,19 106.5,18.75 v106.5,17.55 | v112.45,8.1 112.15,7.8 IC2.9
  Top 0.406: 96.25,17.25 R3.1
  Bottom 0.254: v106.5,17.55 106.5,14.6 109.15,11.95 109.15,8.8 109.85,8.1 v112.45,8.1
WD_TRIGGER  (via drill 0.3)
  Top 0.254: v115.1,5.8 IC2.15
  Top 0.406: IC1.2 96.36,15.36 96.5,15.5 96.4,15.5 R4.1 92.25,15.25 v92,15.5
  vcc 0.254: v92,15.5 92,15 92.25,14.75 99.25,14.75 101.35,16.85 v107.55,16.85
  Bottom 0.254: v107.55,16.85 109.1,16.85 109.65,16.3 109.65,14.4 110.7,13.35 112.8,13.35 113.95,12.2 113.95,8.1 115.1,6.95 v115.1,5.8
ZWISCHENWERT  (via drill 0.3 pad 0.4)
  Top 0.305: v34.12,10.25 R22.2 | D2.A 52.5,3.61 52.5,3.62 v51.25,3.62
  vcc 0.305: v34.12,10.25 32.25,10.25 31.88,9.88 31.88,3 32.38,2.5 50.88,2.5 51.25,2.88 v51.25,3.62
  pour Top (no thermals): 28.38,9.12 33.12,9.12 33.12,10.62 28.38,10.62

### Text on the board
Top: HS
bPlace: www.rj-medical.de | LP-IMP-P1_V3 | Reimers & Janssen GmbH
tTest: VCC | TDI | TDO | TMS | TCK | GND | VCC | R | T | GND
Descript: Bestückungshinweise: | LED1 15mm, Kathode R9, TOP Layer | Sollbruchstelle kurzer CW-Laserkopf | <---
Drill_legend: Bohrlegende | Datum: 20.03.2009 16:07:20 | 4 unterschiedliche Durchmesser | mit Standardsymbol! (210 Bohrungen) | 6.5000 mm / 255.906 mil | 0.8128 mm / 32.000 mil | 0.4000 mm / 15.748 mil | 0.3038 mm / 11.961 mil | 2.0000 mm / 78.740 mil | 1.3000 mm / 51.181 mil